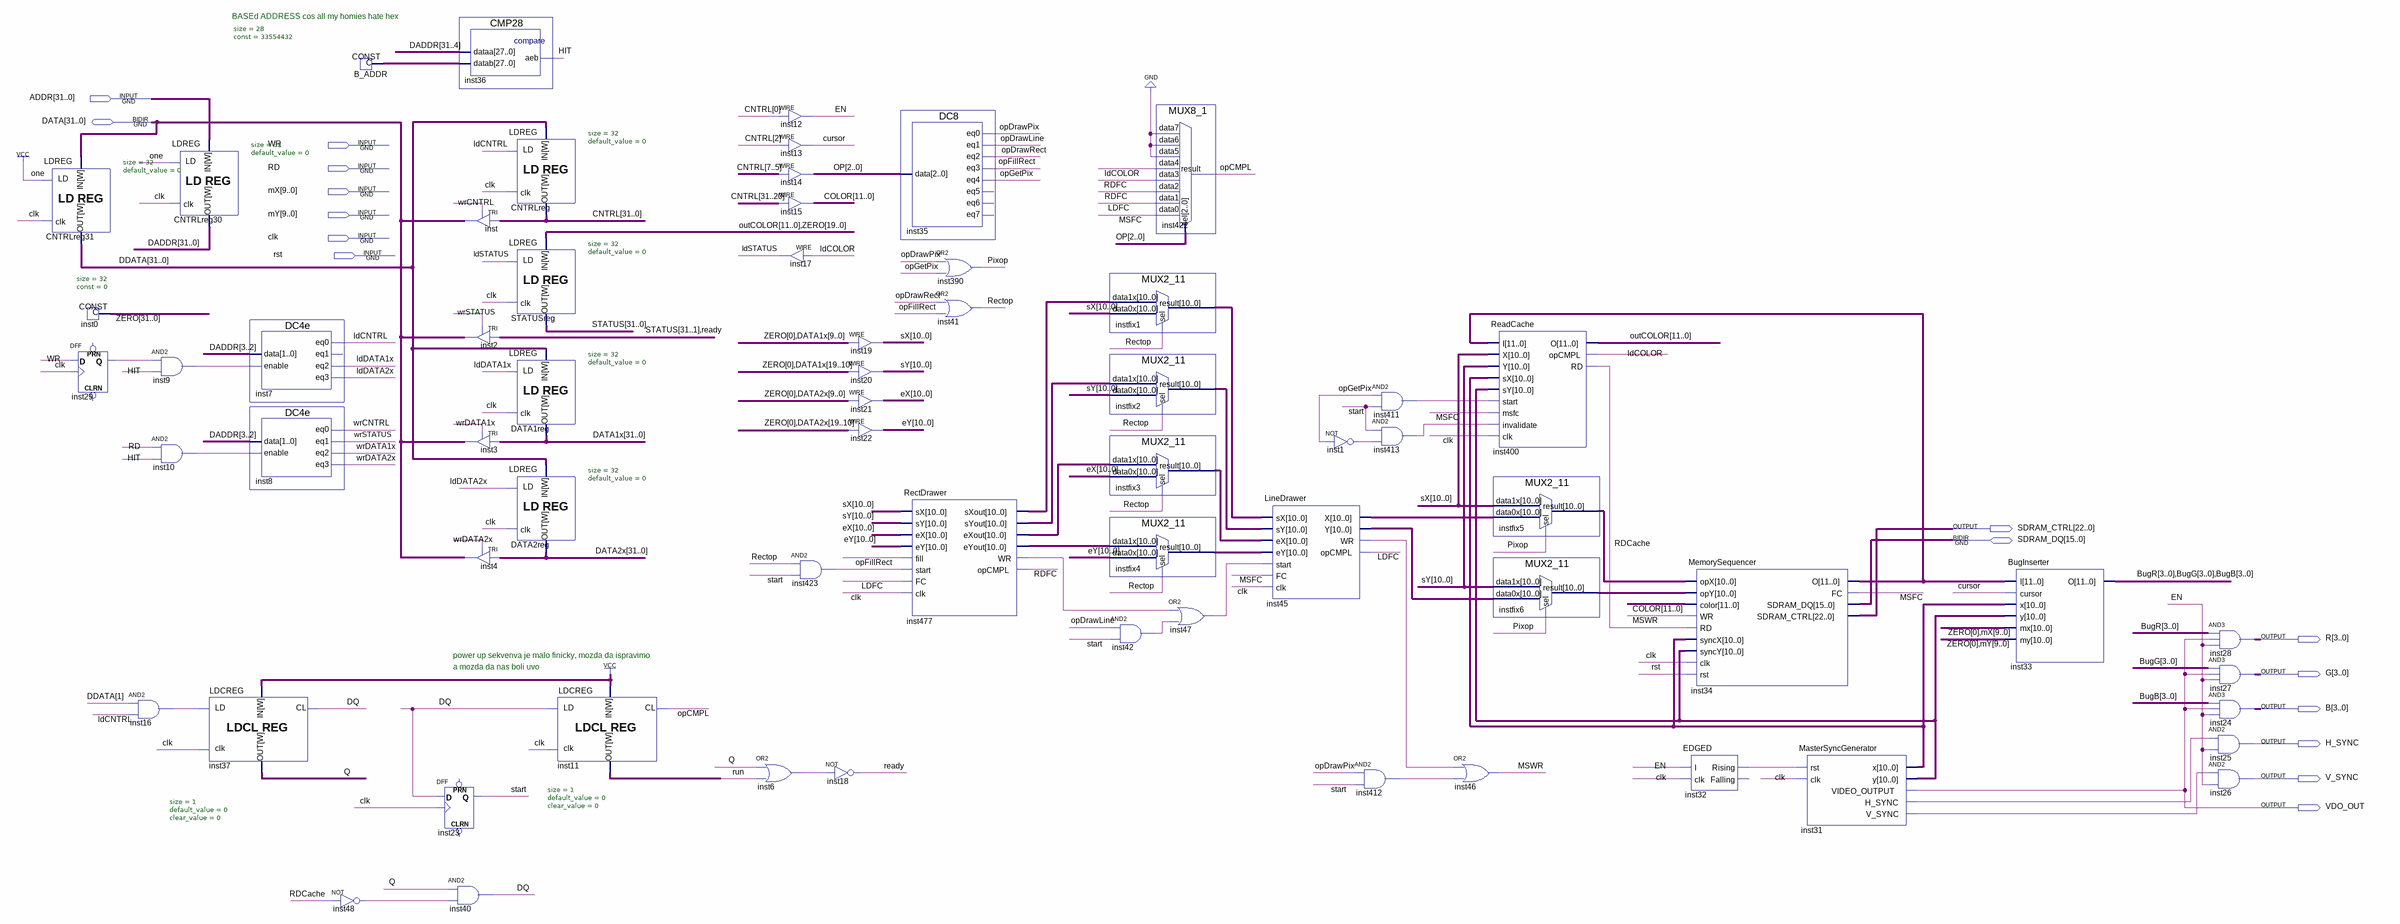
[diagram p0: schematic sheet]
// Quartus schematic GPU.bdf as structural Verilog: 65 symbols, 16 pins
module GPU (
  input  [31:0] ADDR,
  input  WR,
  input  RD,
  input  [9:0] mX,
  input  [9:0] mY,
  input  clk,
  input  rst,
  inout  [31:0] DATA,
  inout  [15:0] SDRAM_DQ,
  output [22:0] SDRAM_CTRL,
  output [3:0] R,
  output [3:0] G,
  output [3:0] B,
  output H_SYNC,
  output V_SYNC,
  output VDO_OUT
);

  wire cursor, DQ, EN, HIT, inst1_out, inst6_out, inst9_out, inst10_out, inst11_data_out, inst16_out,
       inst29_q, inst31_h_sync, inst31_v_sync, inst32_rising, inst42_out, inst45_wr, inst47_out, inst48_out,
       inst411_out, inst412_out, inst413_out, inst423_out, inst477_wr, ldCNTRL, ldCOLOR, ldDATA1x, ldDATA2x,
       LDFC, ldSTATUS, MSFC, MSWR, opCMPL, opDrawLine, opDrawPix, opDrawRect, opFillRect, opGetPix, Pixop, Q,
       RDCache, RDFC, ready, Rectop, run, start, wrCNTRL, wrDATA1x, wrDATA2x, wrSTATUS;
  wire [2:0] OP;
  wire [3:0] BugB, BugG, BugR;
  wire [10:0] eX, eY, inst31_x, inst31_y, inst45_x, inst45_y, inst477_exout, inst477_eyout, inst477_sxout,
       inst477_syout, instfix1_result, instfix2_result, instfix3_result, instfix4_result, instfix5_result,
       instfix6_result, sX, sY;
  wire [11:0] COLOR, inst34_o, outCOLOR;
  wire [27:0] B_ADDR_data;
  wire [31:0] CNTRL, DADDR, DATA1x, DATA2x, DDATA, STATUS, ZERO;

  LDREG #(.size(32), .default_value(0)) CNTRLreg31 (.clk(clk), .data_in(DATA), .ld(1'b1), .data_out(DDATA));
  CONST #(.size(32), .\const (0)) inst0 (.data(ZERO));
  DFF inst29 (.CLK(clk), .D(WR), .Q(inst29_q));  // open: CLRN, PRN
  and inst16 (inst16_out, DDATA[1], ldCNTRL);
  LDREG #(.size(32), .default_value(0)) CNTRLreg30 (.clk(clk), .data_in(ADDR), .ld(1'b1), .data_out(DADDR));
  and inst9 (inst9_out, inst29_q, HIT);
  and inst10 (inst10_out, RD, HIT);
  LDCREG #(.size(1), .default_value(0), .clear_value(0)) inst37 (
    .clk(clk), .data_in(1'b1), .cl(DQ), .ld(inst16_out), .data_out(Q));
  DC4e inst7 (.data(DADDR[3:2]), .enable(inst9_out), .eq0(ldCNTRL), .eq2(ldDATA1x), .eq3(ldDATA2x));  // open: eq1
  DC4e inst8 (.data(DADDR[3:2]), .enable(inst10_out), .eq0(wrCNTRL), .eq1(wrSTATUS), .eq2(wrDATA1x), .eq3(wrDATA2x));
  CONST #(.size(28), .\const (33554432)) B_ADDR (.data(B_ADDR_data));
  not inst48 (inst48_out, RDCache);
  CMP28 inst36 (.dataa(DADDR[31:4]), .datab(B_ADDR_data), .aeb(HIT));
  TRI inst[31:0] (.IN(CNTRL), .OE(wrCNTRL), .OUT(DATA));
  TRI inst2[31:0] (.IN({STATUS[31:1], ready}), .OE(wrSTATUS), .OUT(DATA));
  TRI inst3[31:0] (.IN(DATA1x), .OE(wrDATA1x), .OUT(DATA));
  TRI inst4[31:0] (.IN(DATA2x), .OE(wrDATA2x), .OUT(DATA));
  DFF inst23 (.CLK(clk), .D(DQ), .Q(start));  // open: CLRN, PRN
  and inst40 (DQ, Q, inst48_out);
  LDREG #(.size(32), .default_value(0)) CNTRLreg (.clk(clk), .data_in(DDATA), .ld(ldCNTRL), .data_out(CNTRL));
  LDREG #(.size(32), .default_value(0)) STATUSreg (
    .clk(clk), .data_in({outCOLOR, ZERO[19:0]}), .ld(ldSTATUS), .data_out(STATUS));
  LDREG #(.size(32), .default_value(0)) DATA1reg (.clk(clk), .data_in(DDATA), .ld(ldDATA1x), .data_out(DATA1x));
  LDREG #(.size(32), .default_value(0)) DATA2reg (.clk(clk), .data_in(DDATA), .ld(ldDATA2x), .data_out(DATA2x));
  LDCREG #(.size(1), .default_value(0), .clear_value(0)) inst11 (
    .clk(clk), .data_in(1'b1), .cl(opCMPL), .ld(DQ), .data_out(inst11_data_out));
  assign EN = CNTRL[0];  // WIRE inst12
  assign cursor = CNTRL[2];  // WIRE inst13
  assign OP = CNTRL[7:5];  // WIRE inst14
  assign COLOR = CNTRL[31:20];  // WIRE inst15
  assign ldSTATUS = ldCOLOR;  // WIRE inst17
  and inst423 (inst423_out, Rectop, start);
  or inst6 (inst6_out, Q, run);
  not inst18 (ready, inst6_out);
  assign sX = {ZERO[0], DATA1x[9:0]};  // WIRE inst19
  assign sY = {ZERO[0], DATA1x[19:10]};  // WIRE inst20
  assign eX = {ZERO[0], DATA2x[9:0]};  // WIRE inst21
  assign eY = {ZERO[0], DATA2x[19:10]};  // WIRE inst22
  DC8 inst35 (
    .data(OP), .eq0(opDrawPix), .eq1(opDrawLine), .eq2(opDrawRect), .eq3(opFillRect), .eq4(opGetPix));  // open: eq5, eq6, eq7
  RectDrawer inst477 (
    .sX(sX), .sY(sY), .eX(eX), .eY(eY), .fill(opFillRect), .start(inst423_out), .FC(LDFC), .clk(clk),
    .sXout(inst477_sxout), .sYout(inst477_syout), .eXout(inst477_exout), .eYout(inst477_eyout),
    .WR(inst477_wr), .opCMPL(RDFC));
  or inst390 (Pixop, opDrawPix, opGetPix);
  or inst41 (Rectop, opDrawRect, opFillRect);
  MUX2_11 instfix1 (.data1x(inst477_sxout), .data0x(sX), .sel(Rectop), .result(instfix1_result));
  MUX2_11 instfix2 (.data1x(inst477_syout), .data0x(sY), .sel(Rectop), .result(instfix2_result));
  MUX2_11 instfix3 (.data1x(inst477_exout), .data0x(eX), .sel(Rectop), .result(instfix3_result));
  MUX2_11 instfix4 (.data1x(inst477_eyout), .data0x(eY), .sel(Rectop), .result(instfix4_result));
  and inst42 (inst42_out, opDrawLine, start);
  MUX8_1 inst422 (
    .data7(1'b0), .data6(1'b0), .data5(1'b0), .data4(ldCOLOR), .data3(RDFC), .data2(RDFC), .data1(LDFC),
    .data0(MSFC), .sel(OP), .result(opCMPL));
  or inst47 (inst47_out, inst477_wr, inst42_out);
  LineDrawer inst45 (
    .sX(instfix1_result), .sY(instfix2_result), .eX(instfix3_result), .eY(instfix4_result),
    .start(inst47_out), .FC(MSFC), .clk(clk), .X(inst45_x), .Y(inst45_y), .WR(inst45_wr), .opCMPL(LDFC));
  not inst1 (inst1_out, opGetPix);
  and inst411 (inst411_out, opGetPix, start);
  and inst413 (inst413_out, start, inst1_out);
  and inst412 (inst412_out, opDrawPix, start);
  ReadCache inst400 (
    .I(inst34_o), .X(sX), .Y(sY), .sX(inst31_x), .sY(inst31_y), .start(inst411_out), .msfc(MSFC),
    .invalidate(inst413_out), .clk(clk), .O(outCOLOR), .opCMPL(ldCOLOR), .RD(RDCache));
  or inst46 (MSWR, inst45_wr, inst412_out);
  MUX2_11 instfix5 (.data1x(sX), .data0x(inst45_x), .sel(Pixop), .result(instfix5_result));
  MUX2_11 instfix6 (.data1x(sY), .data0x(inst45_y), .sel(Pixop), .result(instfix6_result));
  MemorySequencer inst34 (
    .opX(instfix5_result), .opY(instfix6_result), .color(COLOR), .WR(MSWR), .RD(RDCache), .syncX(inst31_x),
    .syncY(inst31_y), .clk(clk), .rst(rst), .O(inst34_o), .FC(MSFC), .SDRAM_CTRL(SDRAM_CTRL),
    .SDRAM_DQ(SDRAM_DQ));
  EDGED inst32 (.I(EN), .clk(clk), .Rising(inst32_rising));  // open: Falling
  MasterSyncGenerator inst31 (
    .rst(inst32_rising), .clk(clk), .x(inst31_x), .y(inst31_y), .VIDEO_OUTPUT(VDO_OUT),
    .H_SYNC(inst31_h_sync), .V_SYNC(inst31_v_sync));
  BugInserter inst33 (
    .I(inst34_o), .cursor(cursor), .x(inst31_x), .y(inst31_y), .mx({ZERO[0], mX}), .my({ZERO[0], mY}),
    .O({BugR, BugG, BugB}));
  assign R = BugR & {4{VDO_OUT}} & {4{EN}};  // AND3 inst28, 4 bits wide
  assign G = BugG & {4{VDO_OUT}} & {4{EN}};  // AND3 inst27, 4 bits wide
  assign B = BugB & {4{VDO_OUT}} & {4{EN}};  // AND3 inst24, 4 bits wide
  and inst25 (H_SYNC, inst31_h_sync, EN);
  and inst26 (V_SYNC, inst31_v_sync, EN);

  // Notes on the sheet:
  //   BASEd ADDRESS cos all my homies hate hex
  //   power up sekvenva je malo finicky, mozda da ispravimo
  //   a mozda da nas boli uvo
endmodule
